# Altium project Lezzetli_Robot_Tarifleri_Eğitim_Robotu.PrjPcb
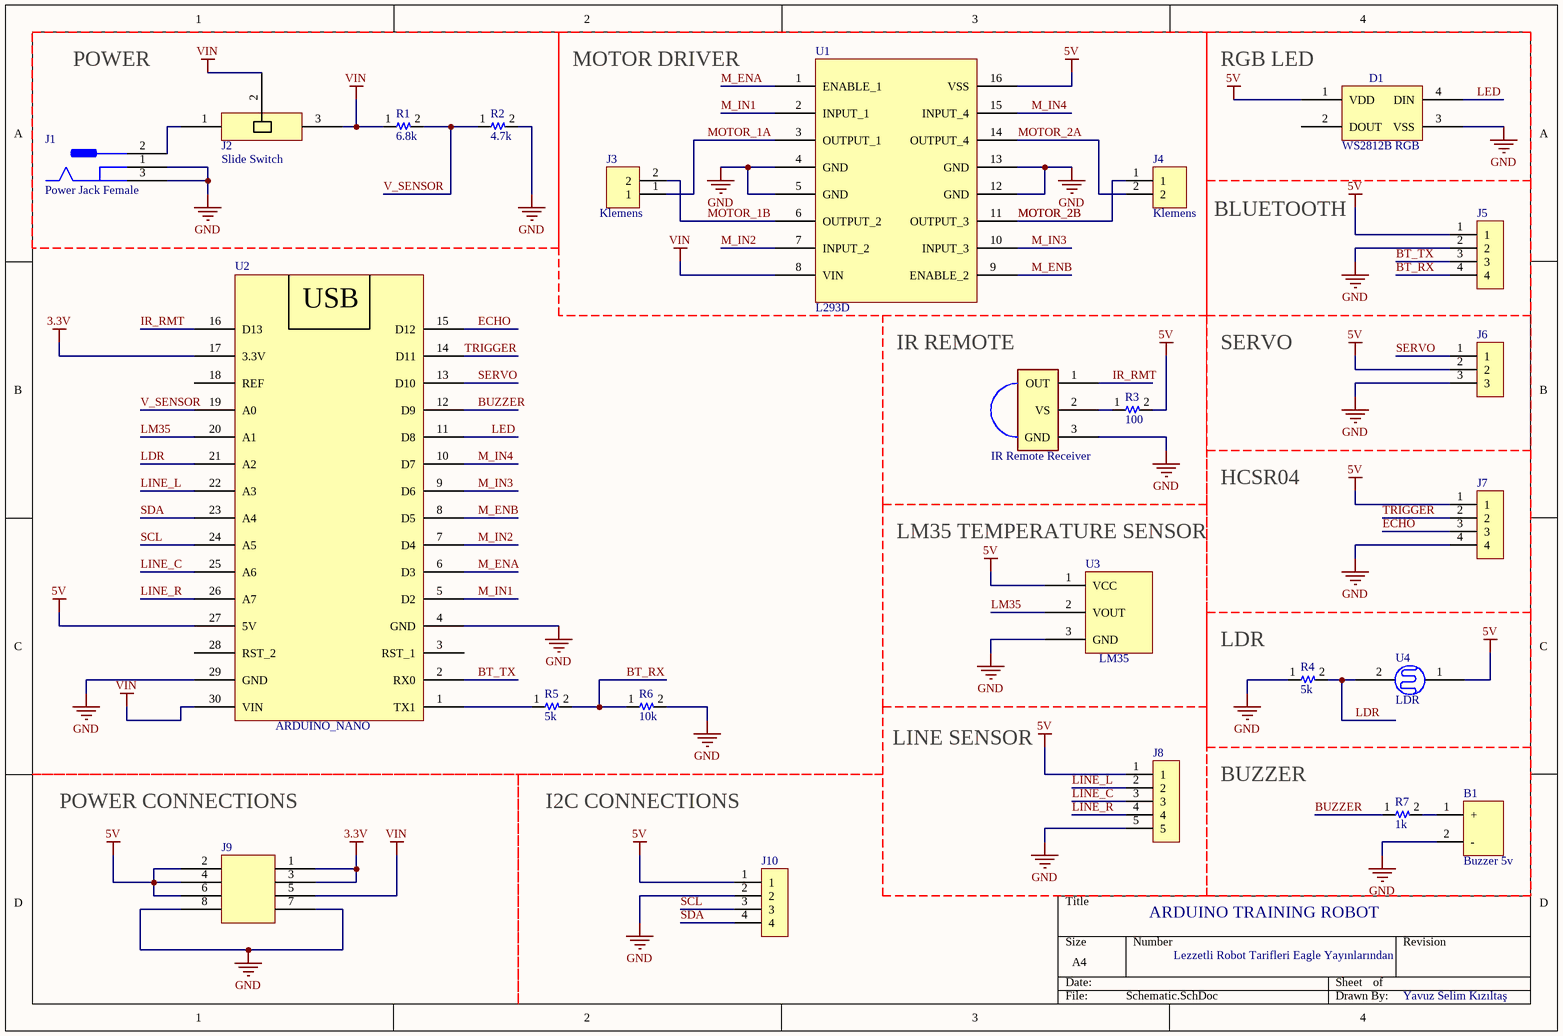
[diagram p0: Schematic.SchDoc]
1 sheet, 24 parts. Net scope: global (net labels, ports and power ports of the same name join across sheets).
Board file: Board.PcbDoc

## Sheet Schematic.SchDoc
size A4; SheetNumber: 1; SheetTotal: 1

### Parts
?  IR Remote Receiver  [IR Remote Receiver]
B1  Buzzer 5v  [Buzzer 5v]
D1  WS2812B RGB  [WS2812B RGB]
J1  Power Jack Female  [Power Jack Female]
J2  Slide Switch  [Slide Switch]
J3  Klemens  [Klemens 1x2 - 3.5mm]
J4  Klemens  [Klemens 1x2 - 3.5mm]
J5  Header 2.54 1x4  [Header 2.54 1x4 Female]  (value not drawn)
J6  1x3 Male Header  [1x3 Male Header]  (value not drawn)
J7  Header 2.54 1x4  [Header 2.54 1x4 Female]  (value not drawn)
J8  Header 2.54 1x5  [Header 2.54 1x5 Female]  (value not drawn)
J9  2x4 Male Header  [2x4 Male header]  (value not drawn)
J10  Header 2.54 1x4  [Header 2.54 1x4 Female]  (value not drawn)
R1  6.8k  [RESISTOR DIP]
R2  4.7k  [RESISTOR DIP]
R3  100  [RESISTOR DIP]
R4  5k  [RESISTOR DIP]
R5  5k  [RESISTOR DIP]
R6  10k  [RESISTOR DIP]
R7  1k  [RESISTOR DIP]
U1  L293D  [L293D]
U2  ARDUINO_NANO  [ARDUINO_NANO]
U3  LM35  [LM35]
U4  LDR  [LDR]

### Nets
3.3V: J9.1 J9.3 U2.17(3.3V)
5V: D1.1(VDD) J5.1 J6.2 J7.1 J8.1 J9.2 J9.4 J9.6 J10.1 R3.2 U1.16(VSS) U2.27(5V) U3.1(VCC) U4.1
GND: ?.3(GND) B1.2(-) D1.3(VSS) J1.1 J1.3 J5.2 J6.3 J7.4 J8.5 J9.7 J9.8 J10.2 R2.2 R4.1 R6.2 U1.4(GND) U1.5(GND) U1.12(GND) U1.13(GND) U2.4(GND) U2.29(GND) U3.3(GND)
VIN: J2.2(VSS) J2.3(VSS) J9.5 R1.1 U1.8(VIN) U2.30(VIN)
BT_RX: J5.4 R5.2 R6.1
BT_TX: J5.3 U2.2(RX0)
BUZZER: R7.1 U2.12(D9)
ECHO: J7.3 U2.15(D12)
IR_RMT: ?.1(OUT) U2.16(D13)
LDR: R4.2 U2.21(A2) U4.2
LED: D1.4(DIN) U2.11(D8)
LINE_C: J8.3 U2.25(A6)
LINE_L: J8.2 U2.22(A3)
LINE_R: J8.4 U2.26(A7)
LM35: U2.20(A1) U3.2(VOUT)
M_ENA: U1.1(ENABLE_1) U2.6(D3)
M_ENB: U1.9(ENABLE_2) U2.8(D5)
M_IN1: U1.2(INPUT_1) U2.5(D2)
M_IN2: U1.7(INPUT_2) U2.7(D4)
M_IN3: U1.10(INPUT_3) U2.9(D6)
M_IN4: U1.15(INPUT_4) U2.10(D7)
MOTOR_1A: J3.1 U1.3(OUTPUT_1)
MOTOR_1B: J3.2 U1.6(OUTPUT_2)
MOTOR_2A: J4.2 U1.14(OUTPUT_4)
MOTOR_2B: J4.1 U1.11(OUTPUT_3)
SCL: J10.3 U2.24(A5)
SDA: J10.4 U2.23(A4)
SERVO: J6.1 U2.13(D10)
TRIGGER: J7.2 U2.14(D11)
V_SENSOR: R1.2 R2.1 U2.19(A0)
Net?_2: ?.2(VS) R3.1
NetB1_1: B1.1(+) R7.2
NetJ1_2: J1.2(VCC) J2.1(VSS)
NetR5_1: R5.1 U2.1(TX1)

Not connected (* = marked no-connect by the designer): D1 2(DOUT); U2 3(RST_1) 18(REF) 28(RST_2)

### Notes on the sheet
- POWER
- MOTOR DRIVER
- (near D1) RGB LED
- BLUETOOTH
- IR REMOTE
- SERVO
- HCSR04
- (near U3) LM35 TEMPERATURE SENSOR
- LDR
- LINE SENSOR
- BUZZER
- POWER CONNECTIONS
- I2C CONNECTIONS
- ARDUINO TRAINING ROBOT
- Lezzetli Robot Tarifleri Eagle Yayınlarından
- Yavuz Selim Kızıltaş
- (in symbol ARDUINO_NANO) USB

### Library data of the parts
D1 = WS2812B RGB: WS2812B RGB LED
J3 J4 = Klemens 1x2 3.5mm
R1-R7 = RESISTOR DIP: Parameter 1: *
U1 = L293D: L293D Motor Driver
U3 = LM35: LM35 Sıcaklık Sensörü